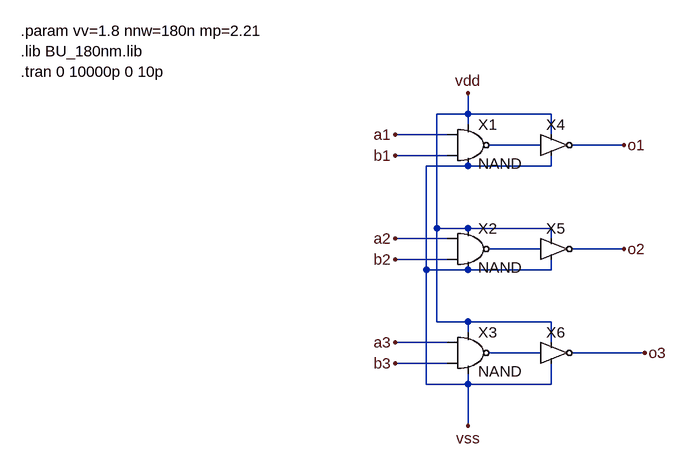
[diagram p0: schematic and3b.asc]
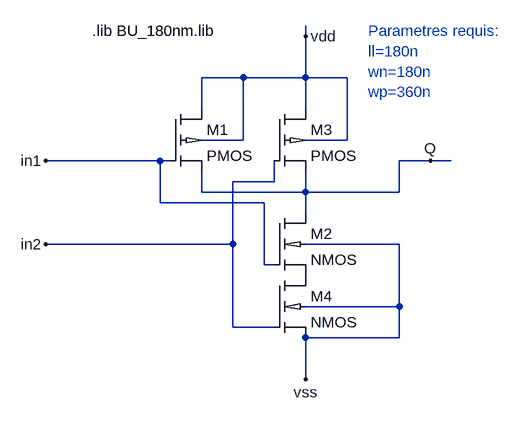
[diagram p1: sub-circuit nand.asc]
and3b.asc, the LTspice schematic file:
Version 4
SHEET 1 880 1032
WIRE 0 144 0 112
WIRE 0 144 -48 144
WIRE 128 144 0 144
WIRE 0 160 0 144
WIRE -32 176 -112 176
WIRE 128 176 128 144
WIRE 112 192 32 192
WIRE 240 192 160 192
WIRE -32 208 -112 208
WIRE 0 224 -64 224
WIRE 128 224 128 208
WIRE 128 224 0 224
WIRE -48 320 -48 144
WIRE 0 320 -48 320
WIRE 128 320 0 320
WIRE -32 336 -112 336
WIRE 128 336 128 320
WIRE 112 352 32 352
WIRE 240 352 160 352
WIRE -32 368 -112 368
WIRE -64 384 -64 224
WIRE 0 384 -64 384
WIRE 128 384 128 368
WIRE 128 384 0 384
WIRE -48 464 -48 320
WIRE 0 464 -48 464
WIRE 128 464 0 464
WIRE 0 480 0 464
WIRE -32 496 -112 496
WIRE 128 496 128 464
WIRE 112 512 32 512
WIRE 272 512 160 512
WIRE -32 528 -112 528
WIRE -64 560 -64 384
WIRE 0 560 0 544
WIRE 0 560 -64 560
WIRE 128 560 128 528
WIRE 128 560 0 560
WIRE 0 624 0 560
FLAG 0 112 vdd
FLAG 240 192 o1
FLAG 240 352 o2
FLAG 272 512 o3
FLAG -112 176 a1
FLAG -112 336 a2
FLAG -112 496 a3
FLAG -112 208 b1
FLAG -112 368 b2
FLAG -112 528 b3
FLAG 0 624 vss
SYMBOL nand 0 192 R0
SYMATTR InstName X1
SYMATTR SpiceLine ll=180n wn={2*nnw} wp={nnw*mp/2}
SYMBOL nand 0 352 R0
SYMATTR InstName X2
SYMATTR SpiceLine ll=180n wn={2*nnw} wp={nnw*mp/2}
SYMBOL nand 0 512 R0
SYMATTR InstName X3
SYMATTR SpiceLine ll=180n wn={2*nnw} wp={nnw*mp/2}
SYMBOL inv 128 192 R0
SYMATTR InstName X4
SYMATTR SpiceLine ll=180n wn={nnw} wp={nnw*mp}
SYMBOL inv 128 352 R0
SYMATTR InstName X5
SYMATTR SpiceLine ll=180n wn={nnw} wp={nnw*mp}
SYMBOL inv 128 512 R0
SYMATTR InstName X6
SYMATTR SpiceLine ll=180n wn={nnw} wp={nnw*mp}
TEXT -688 16 Left 2 !.param vv=1.8 nnw=180n mp=2.21\n.lib BU_180nm.lib\n.tran 0 10000p 0 10p

nand.asc, the sub-circuit schematic file:
Version 4
SHEET 1 1192 788
WIRE 448 176 448 160
WIRE 352 240 288 240
WIRE 448 240 448 176
WIRE 448 240 352 240
WIRE 512 240 448 240
WIRE 288 288 288 240
WIRE 448 288 448 240
WIRE 352 336 352 240
WIRE 352 336 288 336
WIRE 512 336 512 240
WIRE 512 336 448 336
WIRE 224 368 48 368
WIRE 240 368 224 368
WIRE 640 368 592 368
WIRE 672 368 640 368
WIRE 400 400 400 368
WIRE 400 400 336 400
WIRE 288 416 288 384
WIRE 448 416 448 384
WIRE 448 416 288 416
WIRE 592 416 592 368
WIRE 592 416 448 416
WIRE 224 432 224 368
WIRE 384 432 224 432
WIRE 448 448 448 416
WIRE 336 496 336 400
WIRE 336 496 48 496
WIRE 592 496 448 496
WIRE 384 528 384 432
WIRE 400 528 384 528
WIRE 592 592 592 496
WIRE 592 592 448 592
WIRE 336 624 336 496
WIRE 400 624 336 624
WIRE 592 640 592 592
WIRE 592 640 448 640
WIRE 448 704 448 640
FLAG 448 176 vdd
FLAG 448 704 vss
FLAG 640 368 Q
FLAG 48 368 in1
FLAG 48 496 in2
SYMBOL pmos018 240 288 R0
SYMATTR InstName M1
SYMATTR Value2 l={ll} w={wp} ad={450n*{wp}} as={450n*{wp}} pd={900n+{wp}} ps={1080n+{wp}}
SYMBOL nmos018 400 448 R0
SYMATTR InstName M2
SYMATTR Value2 l={ll} w={wn} ad={450n*{wn}} as={450n*{wn}} pd={900n+{wn}} ps={1080n+{wn}}
SYMBOL pmos018 400 288 R0
SYMATTR InstName M3
SYMATTR Value2 l={ll} w={wp} ad={450n*{wp}} as={450n*{wp}} pd={900n+{wp}} ps={1080n+{wp}}
SYMBOL nmos018 400 544 R0
SYMATTR InstName M4
SYMATTR Value2 l={ll} w={wn} ad={450n*{wn}} as={450n*{wn}} pd={900n+{wn}} ps={1080n+{wn}}
TEXT 120 168 Left 2 !.lib BU_180nm.lib
TEXT 544 168 Left 2 ;Parametres requis: \nll=180n\nwn=180n \nwp=360n

The netlist it stands for:
* and3b.asc
XX1 a1 N001 vdd vss b1 nand params: NAND ll=180n wn={2*nnw} wp={nnw*mp/2}
XX2 a2 N002 vdd vss b2 nand params: NAND ll=180n wn={2*nnw} wp={nnw*mp/2}
XX3 a3 N003 vdd vss b3 nand params: NAND ll=180n wn={2*nnw} wp={nnw*mp/2}
XX4 N001 o1 vdd vss inv ll=180n wn={nnw} wp={nnw*mp}  ; pins In _Q vdd vss
XX5 N002 o2 vdd vss inv ll=180n wn={nnw} wp={nnw*mp}  ; pins In _Q vdd vss
XX6 N003 o3 vdd vss inv ll=180n wn={nnw} wp={nnw*mp}  ; pins In _Q vdd vss

* block symbol definitions
.subckt nand in1 Q vdd vss in2
M1 vdd in1 Q vdd PMOS l={ll} w={wp} ad={450n*{wp}} as={450n*{wp}} pd={900n+{wp}} ps={1080n+{wp}}
M2 Q in1 P001 vss NMOS l={ll} w={wn} ad={450n*{wn}} as={450n*{wn}} pd={900n+{wn}} ps={1080n+{wn}}
M3 vdd in2 Q vdd PMOS l={ll} w={wp} ad={450n*{wp}} as={450n*{wp}} pd={900n+{wp}} ps={1080n+{wp}}
M4 P001 in2 vss vss NMOS l={ll} w={wn} ad={450n*{wn}} as={450n*{wn}} pd={900n+{wn}} ps={1080n+{wn}}
.lib BU_180nm.lib
* Parametres requis:
* ll=180n
* wn=180n
* wp=360n
.ends nand

.model NMOS NMOS
.model PMOS PMOS
.lib standard.mos
.param vv=1.8 nnw=180n mp=2.21
.lib BU_180nm.lib
.tran 0 10000p 0 10p
.lib BU_180nm.lib
.backanno
.end